# Altium schematic sheet SoundDAC.SchDoc: LiveDesign Evaluation - Video Games
size B; Organization: Altium Limited; Address1: L3, 12a Rodborough Rd; Address2: Frenchs Forest; Address3: NSW; Address4: Australia 2086; DocumentNumber: 12; SheetNumber: 12; SheetTotal: 13
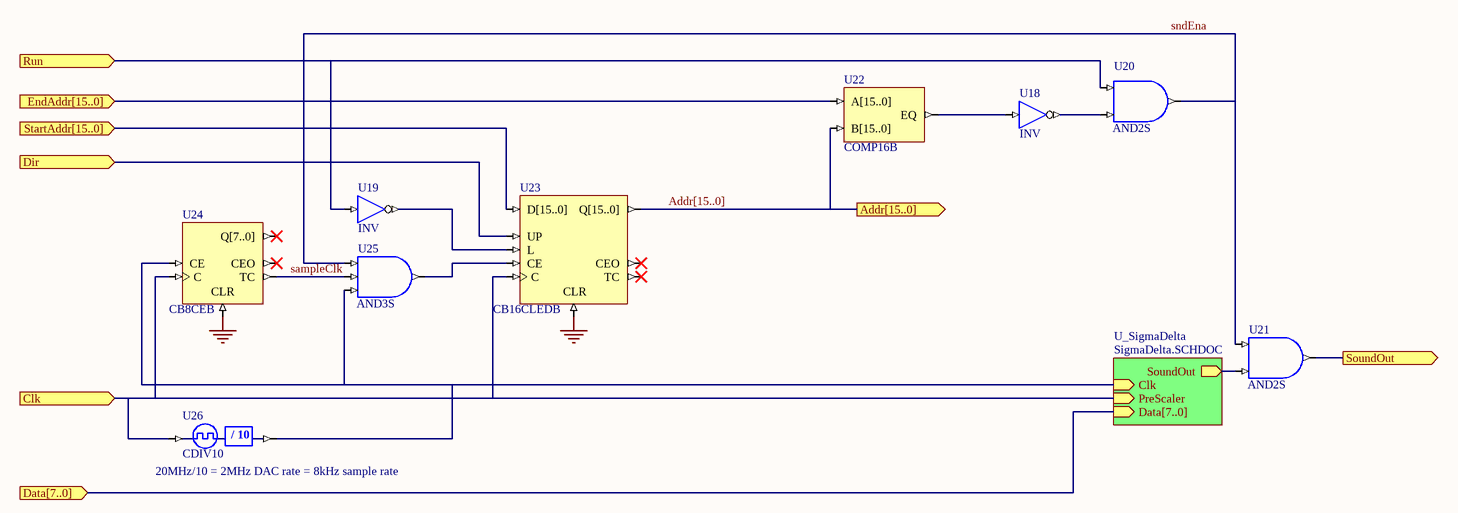
[diagram p0: SoundDAC.SchDoc]

## Parts
U18  INV
U19  INV
U20  AND2S
U21  AND2S
U22  COMP16B
U23  CB16CLEDB
U24  CB8CEB
U25  AND3S
U26  CDIV10

## Sub-sheets
U_SigmaDelta = SigmaDelta.SCHDOC: Clk (in), Data[7..0] (in), SoundOut (out), PreScaler (in)

## Ports
Addr[15..0] (out), Clk (in), Data[7..0] (in), Dir (in), EndAddr[15..0] (in), Run (in), SoundOut (out), StartAddr[15..0] (in)

## Nets
GND: U23.CLR U24.CLR
Addr[15..0]: U22.B[15..0] U23.Q[15..0] ; port Addr[15..0]
Clk: U23.C U24.C U26.CLKIN ; port Clk, sheet U_SigmaDelta/PreScaler
Dir: U23.UP ; port Dir
EndAddr[15..0]: U22.A[15..0] ; port EndAddr[15..0]
Run: U19.I U20.I0 ; port Run
sampleClk: U24.TC U25.I1
sndEna: U20.O U21.I0 U25.I0
SoundOut: U21.O ; port SoundOut
StartAddr[15..0]: U23.D[15..0] ; port StartAddr[15..0]
NetU18_I: U18.I U22.EQ
NetU18_O: U18.O U20.I1
NetU19_O: U19.O U23.L
NetU21_I1: U21.I1 ; sheet U_SigmaDelta/SoundOut
NetU23_CE: U23.CE U25.O
NetU24_CE: U24.CE U25.I2 U26.CLKDV ; sheet U_SigmaDelta/Clk

Not connected (* = marked no-connect by the designer): U23 CEO* TC*; U24 CEO* Q[7..0]*

## Buses and harness runs
bus Addr[15..0] = port Addr[15..0]
bus port Data[7..0] = sheet U_SigmaDelta/Data[7..0]

## Notes on the sheet
- (near U26) 20MHz/10 = 2MHz DAC rate = 8kHz sample rate
- Title
- Size:
- Date:
- B
- Number:
- Time:
- Revision:
- Sheet
- of
- File:
- (in symbol CDIV10) / 10

## Library data of the parts
U18 U19 = INV: Inverter; ArchiveName: GENERIC; Published: 7-Nov-2003; Publisher: Altium Limited; Xilinx Equivalent: INV; Core Revision: 1.00.00
U20 U21 = AND2S: 2-Input AND Gate, Single Pin Version; Xilinx Equivalent: AND2; ArchiveName: GENERIC; Published: 7-Nov-2003; Publisher: Altium Limited; Core Revision: 1.00.00
U22 = COMP16B: 16-Bit Identity Comparator, Bus Version; Xilinx Equivalent: COMP16; ArchiveName: GENERIC; Published: 7-Nov-2003; Publisher: Altium Limited; Core Revision: 1.00.00
U23 = CB16CLEDB: 16-Bit Loadable Cascadable Bidirectional Binary Counter with Clock Enable and Asynchronous Clear, Bus Version; ArchiveName: GENERIC; Published: 18-Dec-2003; Publisher: Altium Limited; Core Revision: 1.00.00; Xilinx Equivalent: CB16CLED
U24 = CB8CEB: 8-Bit Cascadable Binary Counters with Clock Enable and Asynchronous Clear, Bus Version; ArchiveName: GENERIC; Xilinx Equivalent: CB8CE; Published: 18-Dec-2003; Publisher: Altium Limited; Core Revision: 1.00.00
U25 = AND3S: 3-Input AND Gate, Single Pin Version; Xilinx Equivalent: AND3; ArchiveName: GENERIC; Published: 7-Nov-2003; Publisher: Altium Limited; Core Revision: 1.00.00
U26 = CDIV10: Clock Divider by 10; ArchiveName: GENERIC; Published: 18-Dec-2003; Publisher: Altium Limited; Core Revision: 1.00.00